# Altium project AMC_FMC_Carrier v4.PrjPcb (part 6 of 18)

## Sheet FPGA_SUP.SchDoc: AMC FMC Carrier v4
size A2; Organization: WUT ISE; Address1: Warsaw Univeristy of Technology; Address2: Nowowiejska 15/19 00-665 Warsaw; Address3: t.przywozki@gmail.com; DocumentNumber: 16; Revision: 1; SheetNumber: 4; SheetTotal: 29; Project: AMC_FMC_Carrier v4; ModifiedBy: -; CheckedDate: -; Title2: FPGA Power & Decoupling; DivGrp: ISE; Designer: T.Przywozki
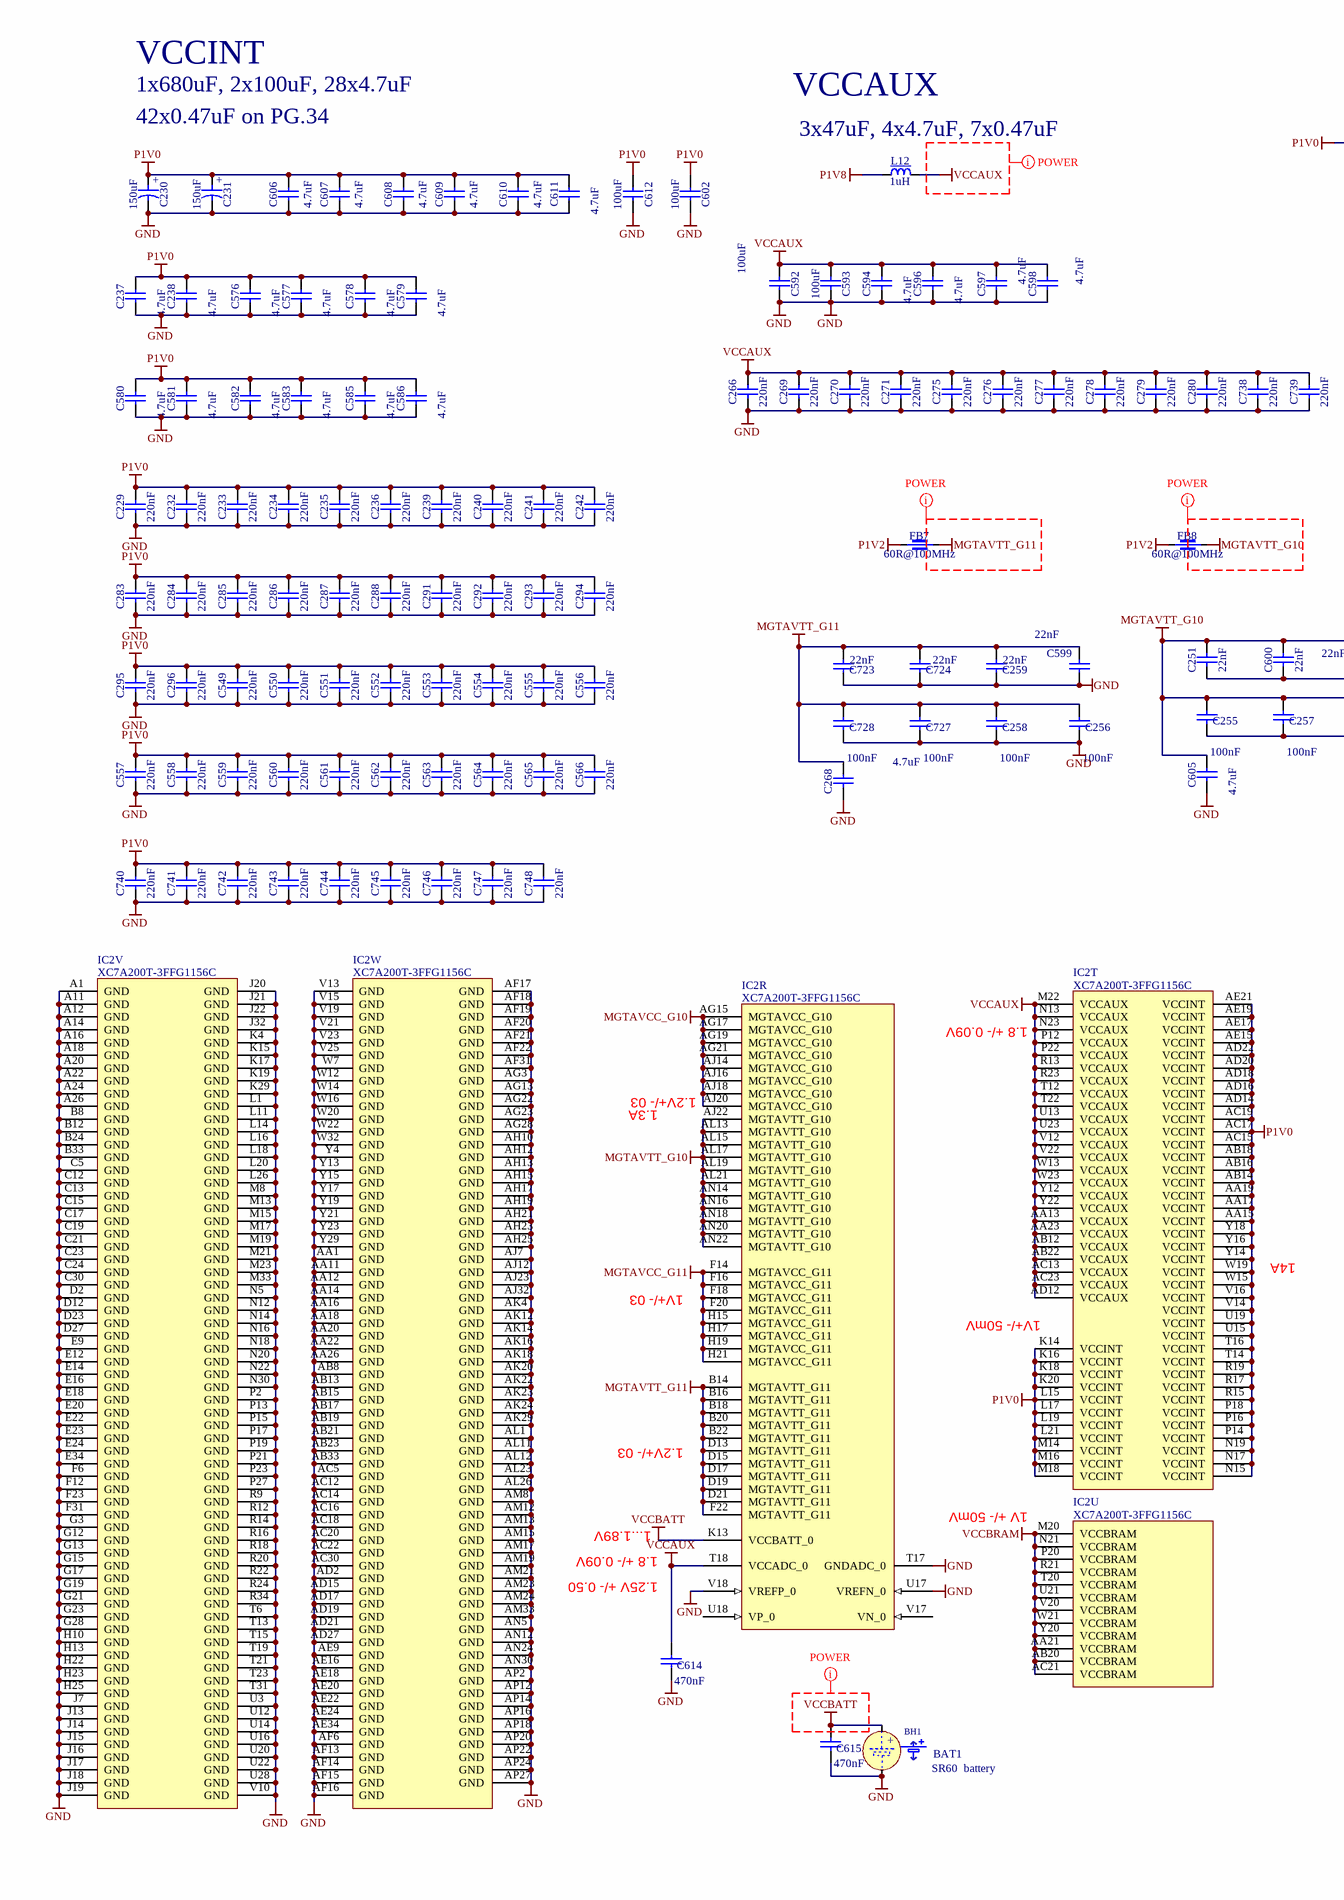
[diagram p10: FPGA_SUP.SchDoc, left]
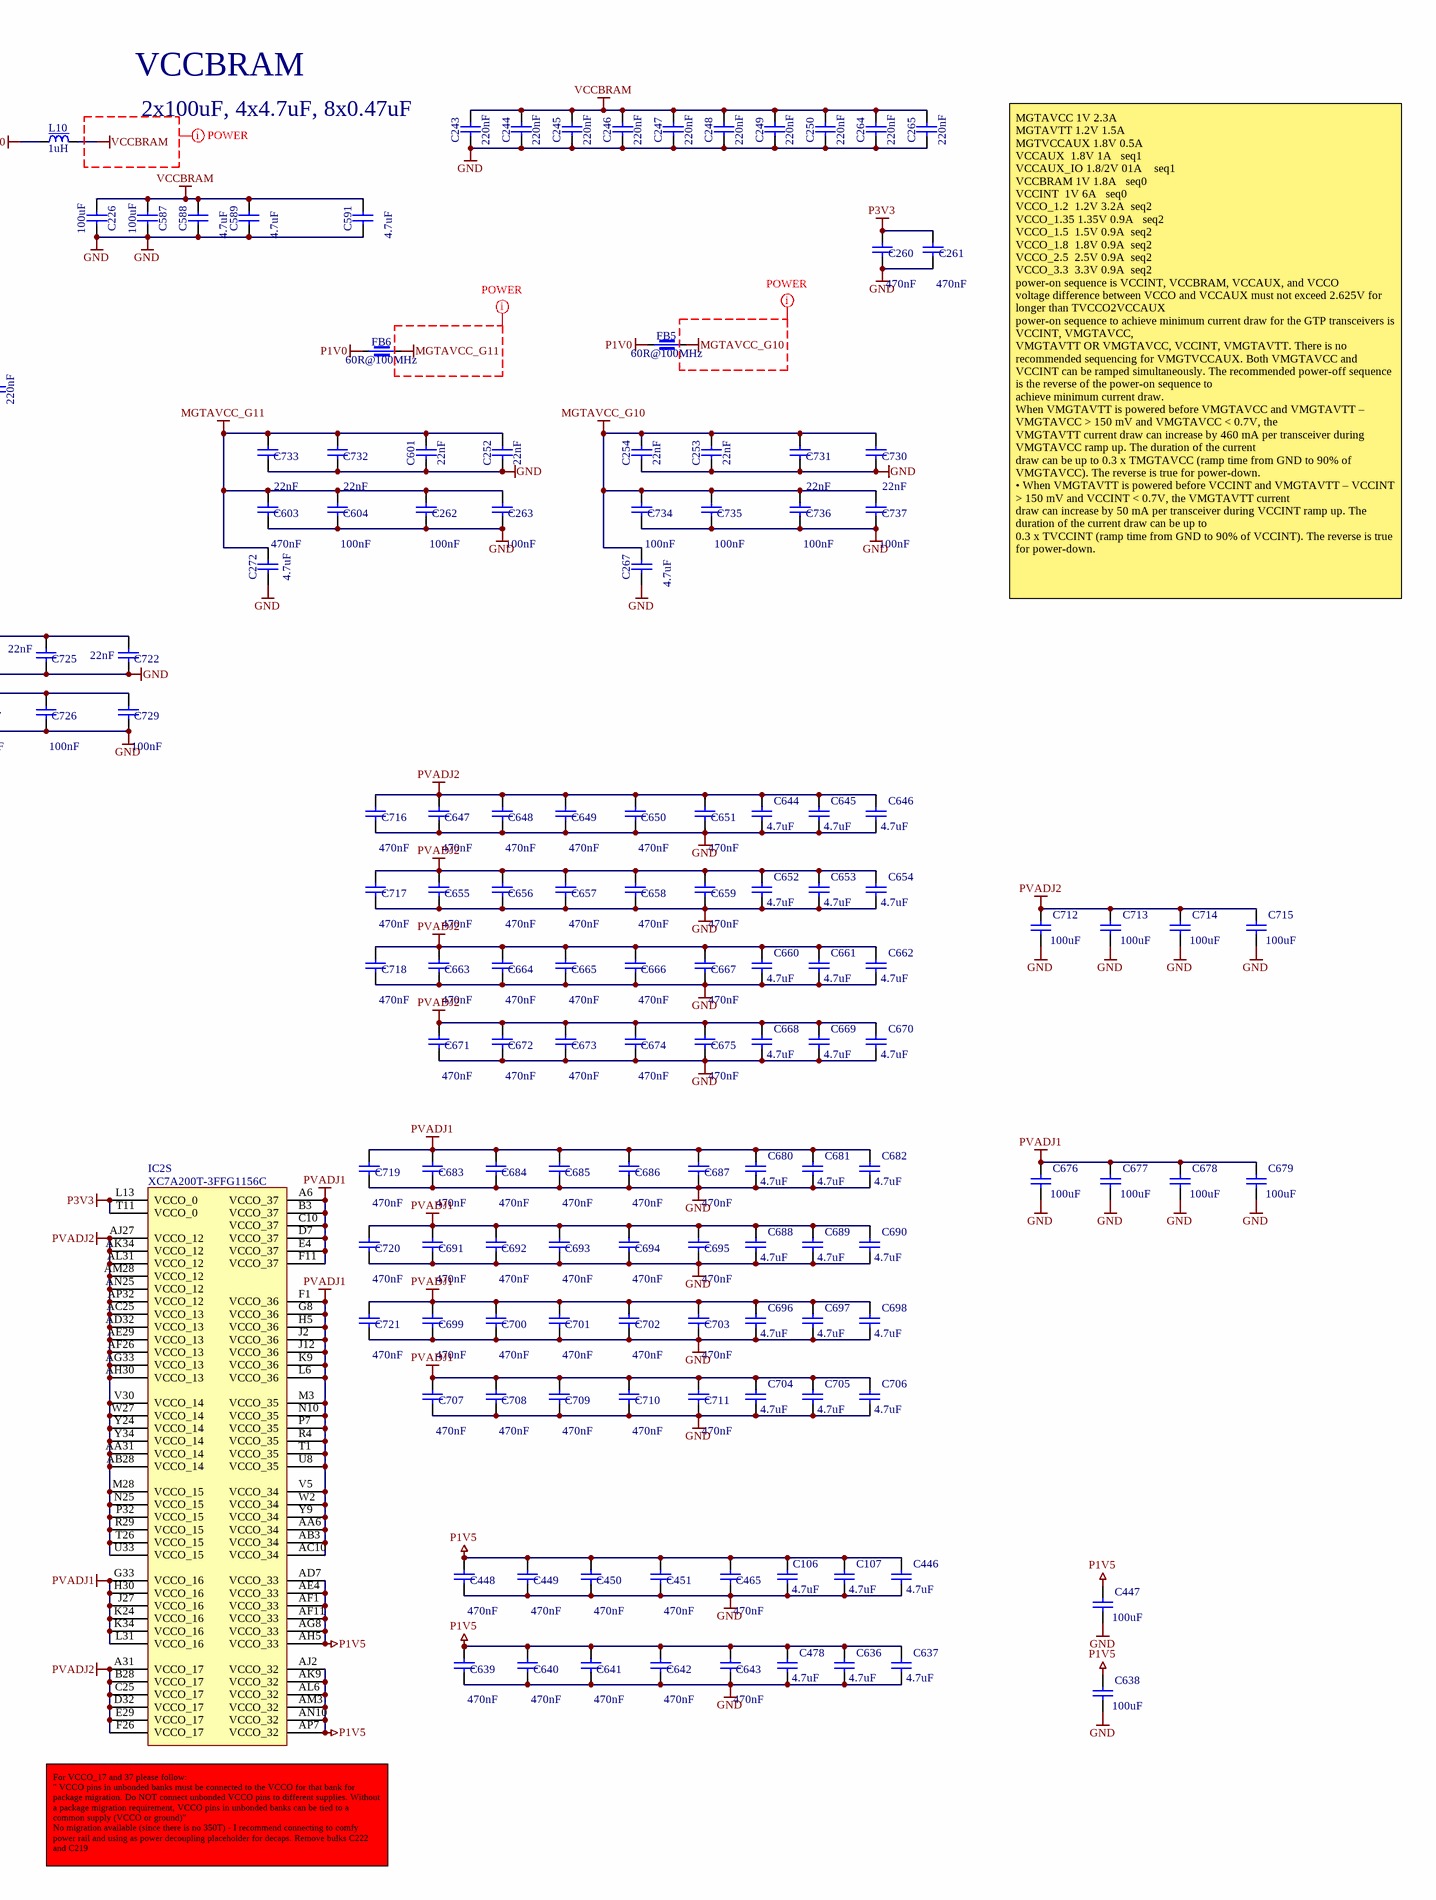
[diagram p11: FPGA_SUP.SchDoc, right]

### Parts
(Parts that share a designator on the sheet are numbered #1, #2 ... from top to bottom, then left to right.)
BAT1  SR60  battery  [SR60]
BH1  (no value)  [BATH_KEYSTONE_2998]
C106  4.7uF  [CAPC1608X87N]
C107  4.7uF  [CAPC1608X87N]
C226  100uF  [CAPC3225X270N]
C229  220nF  [CAPC0603X33N]
C230  150uF  [CAPMP7343X200N]
C231  150uF  [CAPMP7343X200N]
C232  220nF  [CAPC0603X33N]
C233  220nF  [CAPC0603X33N]
C234  220nF  [CAPC0603X33N]
C235  220nF  [CAPC0603X33N]
C236  220nF  [CAPC0603X33N]
C237  4.7uF  [CAPC1608X87N]
C238  4.7uF  [CAPC1608X87N]
C239  220nF  [CAPC0603X33N]
C240  220nF  [CAPC0603X33N]
C241  220nF  [CAPC0603X33N]
C242  220nF  [CAPC0603X33N]
C243  220nF  [CAPC0603X33N]
C244  220nF  [CAPC0603X33N]
C245  220nF  [CAPC0603X33N]
C246  220nF  [CAPC0603X33N]
C247  220nF  [CAPC0603X33N]
C248  220nF  [CAPC0603X33N]
C249  220nF  [CAPC0603X33N]
C250  220nF  [CAPC0603X33N]
C251  22nF  [CAPC0603X33N]
C252  22nF  [CAPC0603X33N]
C253  22nF  [CAPC0603X33N]
C254  22nF  [CAPC0603X33N]
C255  100nF  [CAPC0603X33N]
C256  100nF  [CAPC0603X33N]
C257  100nF  [CAPC0603X33N]
C258  100nF  [CAPC0603X33N]
C259  22nF  [CAPC0603X33N]
C260  470nF  [CAPC0603X33N]
C261  470nF  [CAPC0603X33N]
C262  100nF  [CAPC0603X33N]
C263  100nF  [CAPC0603X33N]
C264  220nF  [CAPC0603X33N]
C265  220nF  [CAPC0603X33N]
C266  220nF  [CAPC0603X33N]
C267  4.7uF  [CAPC1608X87N]
C268  4.7uF  [CAPC1608X87N]
C269  220nF  [CAPC0603X33N]
C270  220nF  [CAPC0603X33N]
C271  220nF  [CAPC0603X33N]
C272  4.7uF  [CAPC1608X87N]
C275  220nF  [CAPC0603X33N]
C276  220nF  [CAPC0603X33N]
C277  220nF  [CAPC0603X33N]
C278  220nF  [CAPC0603X33N]
C279  220nF  [CAPC0603X33N]
C280  220nF  [CAPC0603X33N]
C283  220nF  [CAPC0603X33N]
C284  220nF  [CAPC0603X33N]
C285  220nF  [CAPC0603X33N]
C286  220nF  [CAPC0603X33N]
C287  220nF  [CAPC0603X33N]
C288  220nF  [CAPC0603X33N]
C291  220nF  [CAPC0603X33N]
C292  220nF  [CAPC0603X33N]
C293  220nF  [CAPC0603X33N]
C294  220nF  [CAPC0603X33N]
C295  220nF  [CAPC0603X33N]
C296  220nF  [CAPC0603X33N]
C446  4.7uF  [CAPC1608X87N]
C447  100uF  [CAPC3225X270N]
C448  470nF  [CAPC0603X33N]
C449  470nF  [CAPC0603X33N]
C450  470nF  [CAPC0603X33N]
C451  470nF  [CAPC0603X33N]
C465  470nF  [CAPC0603X33N]
C478  4.7uF  [CAPC1608X87N]
C549  220nF  [CAPC0603X33N]
C550  220nF  [CAPC0603X33N]
C551  220nF  [CAPC0603X33N]
C552  220nF  [CAPC0603X33N]
C553  220nF  [CAPC0603X33N]
C554  220nF  [CAPC0603X33N]
C555  220nF  [CAPC0603X33N]
C556  220nF  [CAPC0603X33N]
C557  220nF  [CAPC0603X33N]
C558  220nF  [CAPC0603X33N]
C559  220nF  [CAPC0603X33N]
C560  220nF  [CAPC0603X33N]
C561  220nF  [CAPC0603X33N]
C562  220nF  [CAPC0603X33N]
C563  220nF  [CAPC0603X33N]
C564  220nF  [CAPC0603X33N]
C565  220nF  [CAPC0603X33N]
C566  220nF  [CAPC0603X33N]
C576  4.7uF  [CAPC1608X87N]
C577  4.7uF  [CAPC1608X87N]
C578  4.7uF  [CAPC1608X87N]
C579  4.7uF  [CAPC1608X87N]
C580  4.7uF  [CAPC1608X87N]
C581  4.7uF  [CAPC1608X87N]
C582  4.7uF  [CAPC1608X87N]
C583  4.7uF  [CAPC1608X87N]
C585  4.7uF  [CAPC1608X87N]
C586  4.7uF  [CAPC1608X87N]
C587  100uF  [CAPC3225X270N]
C588  4.7uF  [CAPC1608X87N]
C589  4.7uF  [CAPC1608X87N]
C591  4.7uF  [CAPC1608X87N]
C592  100uF  [CAPC3225X270N]
C593  100uF  [CAPC3225X270N]
C594  4.7uF  [CAPC1608X87N]
C596  4.7uF  [CAPC1608X87N]
C597  4.7uF  [CAPC1608X87N]
C598  4.7uF  [CAPC1608X87N]
C599  22nF  [CAPC0603X33N]
C600  22nF  [CAPC0603X33N]
C601  22nF  [CAPC0603X33N]
C602  100uF  [CAPC3225X270N]
C603  470nF  [CAPC0603X33N]
C604  100nF  [CAPC0603X33N]
C605  4.7uF  [CAPC1608X87N]
C606  4.7uF  [CAPC1608X87N]
C607  4.7uF  [CAPC1608X87N]
C608  4.7uF  [CAPC1608X87N]
C609  4.7uF  [CAPC1608X87N]
C610  4.7uF  [CAPC1608X87N]
C611  4.7uF  [CAPC1608X87N]
C612  100uF  [CAPC3225X270N]
C614  470nF  [CAPC0603X33N]
C615  470nF  [CAPC0603X33N]
C636  4.7uF  [CAPC1608X87N]
C637  4.7uF  [CAPC1608X87N]
C638  100uF  [CAPC3225X270N]
C639  470nF  [CAPC0603X33N]
C640  470nF  [CAPC0603X33N]
C641  470nF  [CAPC0603X33N]
C642  470nF  [CAPC0603X33N]
C643  470nF  [CAPC0603X33N]
C644  4.7uF  [CAPC1608X87N]
C645  4.7uF  [CAPC1608X87N]
C646  4.7uF  [CAPC1608X87N]
C647  470nF  [CAPC0603X33N]
C648  470nF  [CAPC0603X33N]
C649  470nF  [CAPC0603X33N]
C650  470nF  [CAPC0603X33N]
C651  470nF  [CAPC0603X33N]
C652  4.7uF  [CAPC1608X87N]
C653  4.7uF  [CAPC1608X87N]
C654  4.7uF  [CAPC1608X87N]
C655  470nF  [CAPC0603X33N]
C656  470nF  [CAPC0603X33N]
C657  470nF  [CAPC0603X33N]
C658  470nF  [CAPC0603X33N]
C659  470nF  [CAPC0603X33N]
C660  4.7uF  [CAPC1608X87N]
C661  4.7uF  [CAPC1608X87N]
C662  4.7uF  [CAPC1608X87N]
C663  470nF  [CAPC0603X33N]
C664  470nF  [CAPC0603X33N]
C665  470nF  [CAPC0603X33N]
C666  470nF  [CAPC0603X33N]
C667  470nF  [CAPC0603X33N]
C668  4.7uF  [CAPC1608X87N]
C669  4.7uF  [CAPC1608X87N]
C670  4.7uF  [CAPC1608X87N]
C671  470nF  [CAPC0603X33N]
C672  470nF  [CAPC0603X33N]
C673  470nF  [CAPC0603X33N]
C674  470nF  [CAPC0603X33N]
C675  470nF  [CAPC0603X33N]
C676  100uF  [CAPC3225X270N]
C677  100uF  [CAPC3225X270N]
C678  100uF  [CAPC3225X270N]
C679  100uF  [CAPC3225X270N]
C680  4.7uF  [CAPC1608X87N]
C681  4.7uF  [CAPC1608X87N]
C682  4.7uF  [CAPC1608X87N]
C683  470nF  [CAPC0603X33N]
C684  470nF  [CAPC0603X33N]
C685  470nF  [CAPC0603X33N]
C686  470nF  [CAPC0603X33N]
C687  470nF  [CAPC0603X33N]
C688  4.7uF  [CAPC1608X87N]
C689  4.7uF  [CAPC1608X87N]
C690  4.7uF  [CAPC1608X87N]
C691  470nF  [CAPC0603X33N]
C692  470nF  [CAPC0603X33N]
C693  470nF  [CAPC0603X33N]
C694  470nF  [CAPC0603X33N]
C695  470nF  [CAPC0603X33N]
C696  4.7uF  [CAPC1608X87N]
C697  4.7uF  [CAPC1608X87N]
C698  4.7uF  [CAPC1608X87N]
C699  470nF  [CAPC0603X33N]
C700  470nF  [CAPC0603X33N]
C701  470nF  [CAPC0603X33N]
C702  470nF  [CAPC0603X33N]
C703  470nF  [CAPC0603X33N]
C704  4.7uF  [CAPC1608X87N]
C705  4.7uF  [CAPC1608X87N]
C706  4.7uF  [CAPC1608X87N]
C707  470nF  [CAPC0603X33N]
C708  470nF  [CAPC0603X33N]
C709  470nF  [CAPC0603X33N]
C710  470nF  [CAPC0603X33N]
C711  470nF  [CAPC0603X33N]
C712  100uF  [CAPC3225X270N]
C713  100uF  [CAPC3225X270N]
C714  100uF  [CAPC3225X270N]
C715  100uF  [CAPC3225X270N]
C716  470nF  [CAPC0603X33N]
C717  470nF  [CAPC0603X33N]
C718  470nF  [CAPC0603X33N]
C719  470nF  [CAPC0603X33N]
C720  470nF  [CAPC0603X33N]
C721  470nF  [CAPC0603X33N]
C722  22nF  [CAPC0603X33N]
C723  22nF  [CAPC0603X33N]
C724  22nF  [CAPC0603X33N]
C725  22nF  [CAPC0603X33N]
C726  100nF  [CAPC0603X33N]
C727  100nF  [CAPC0603X33N]
C728  100nF  [CAPC0603X33N]
C729  100nF  [CAPC0603X33N]
C730  22nF  [CAPC0603X33N]
C731  22nF  [CAPC0603X33N]
C732  22nF  [CAPC0603X33N]
C733  22nF  [CAPC0603X33N]
C734  100nF  [CAPC0603X33N]
C735  100nF  [CAPC0603X33N]
C736  100nF  [CAPC0603X33N]
C737  100nF  [CAPC0603X33N]
C738  220nF  [CAPC0603X33N]
C739  220nF  [CAPC0603X33N]
C740  220nF  [CAPC0603X33N]
C741  220nF  [CAPC0603X33N]
C742  220nF  [CAPC0603X33N]
C743  220nF  [CAPC0603X33N]
C744  220nF  [CAPC0603X33N]
C745  220nF  [CAPC0603X33N]
C746  220nF  [CAPC0603X33N]
C747  220nF  [CAPC0603X33N]
C748  220nF  [CAPC0603X33N]
FB5  60R@100MHz  [INDC4516X180N]
FB6  60R@100MHz  [INDC4516X180N]
FB7  60R@100MHz  [INDC4516X180N]
FB8  60R@100MHz  [INDC4516X180N]
IC2#2  XC7A200T-3FFG1156C  [BGA1156C100P34X34_3500X3500X335]  (parts R,S,T,U,V,W of 23)
L10  1uH  [IND_PANASONIC_ELLVGG]
L12  1uH  [IND_PANASONIC_ELLVGG]

### Nets
GND: BH1.2(MINUS) C106.1 C107.1 C226.2 C229.1 C230.2 C231.2 C232.1 C233.1 C234.1 C235.1 C236.1 C237.1 C238.1 C239.1 C240.1 C241.1 C242.1 C243.1 C244.1 C245.1 C246.1 C247.1 C248.1 C249.1 C250.1 C251.1 C252.1 C253.1 C254.1 C255.1 C256.1 C257.1 C258.1 C259.1 C260.1 C261.1 C262.1 C263.1 C264.1 C265.1 C266.1 C267.1 C268.1 C269.1 C270.1 C271.1 C272.1 C275.1 C276.1 C277.1 C278.1 C279.1 C280.1 C283.1 C284.1 C285.1 C286.1 C287.1 C288.1 C291.1 C292.1 C293.1 C294.1 C295.1 C296.1 C446.1 C447.2 C448.1 C449.1 C450.1 C451.1 C465.1 C478.1 C549.1 C550.1 C551.1 C552.1 C553.1 C554.1 C555.1 C556.1 C557.1 C558.1 C559.1 C560.1 C561.1 C562.1 C563.1 C564.1 C565.1 C566.1 C576.1 C577.1 C578.1 C579.1 C580.1 C581.1 C582.1 C583.1 C585.1 C586.1 C587.2 C588.1 C589.1 C591.1 C592.2 C593.2 C594.1 C596.1 C597.1 C598.1 C599.1 C600.1 C601.1 C602.2 C603.1 C604.1 C605.1 C606.1 C607.1 C608.1 C609.1 C610.1 C611.1 C612.2 C614.1 C615.1 C636.1 C637.1 C638.2 C639.1 C640.1 C641.1 C642.1 C643.1 C644.1 C645.1 C646.1 C647.1 C648.1 C649.1 C650.1 C651.1 C652.1 C653.1 C654.1 C655.1 C656.1 C657.1 C658.1 C659.1 C660.1 C661.1 C662.1 C663.1 C664.1 C665.1 C666.1 C667.1 C668.1 C669.1 C670.1 C671.1 C672.1 C673.1 C674.1 C675.1 C676.2 C677.2 C678.2 C679.2 C680.1 C681.1 C682.1 C683.1 C684.1 C685.1 C686.1 C687.1 C688.1 C689.1 C690.1 C691.1 C692.1 C693.1 C694.1 C695.1 C696.1 C697.1 C698.1 C699.1 C700.1 C701.1 C702.1 C703.1 C704.1 C705.1 C706.1 C707.1 C708.1 C709.1 C710.1 C711.1 C712.2 C713.2 C714.2 C715.2 C716.1 C717.1 C718.1 C719.1 C720.1 C721.1 C722.1 C723.1 C724.1 C725.1 C726.1 C727.1 C728.1 C729.1 C730.1 C731.1 C732.1 C733.1 C734.1 C735.1 C736.1 C737.1 C738.1 C739.1 C740.1 C741.1 C742.1 C743.1 C744.1 C745.1 C746.1 C747.1 C748.1 IC2#2.A1(GND) IC2#2.A11(GND) IC2#2.A12(GND) IC2#2.A14(GND) IC2#2.A16(GND) IC2#2.A18(GND) IC2#2.A20(GND) IC2#2.A22(GND) IC2#2.A24(GND) IC2#2.A26(GND) IC2#2.AA1(GND) IC2#2.AA11(GND) IC2#2.AA12(GND) IC2#2.AA14(GND) IC2#2.AA16(GND) IC2#2.AA18(GND) IC2#2.AA20(GND) IC2#2.AA22(GND) IC2#2.AA26(GND) IC2#2.AB8(GND) IC2#2.AB13(GND) IC2#2.AB15(GND) IC2#2.AB17(GND) IC2#2.AB19(GND) IC2#2.AB21(GND) IC2#2.AB23(GND) IC2#2.AB33(GND) IC2#2.AC5(GND) IC2#2.AC12(GND) IC2#2.AC14(GND) IC2#2.AC16(GND) IC2#2.AC18(GND) IC2#2.AC20(GND) IC2#2.AC22(GND) IC2#2.AC30(GND) IC2#2.AD2(GND) IC2#2.AD15(GND) IC2#2.AD17(GND) IC2#2.AD19(GND) IC2#2.AD21(GND) IC2#2.AD27(GND) IC2#2.AE9(GND) IC2#2.AE16(GND) IC2#2.AE18(GND) IC2#2.AE20(GND) IC2#2.AE22(GND) IC2#2.AE24(GND) IC2#2.AE34(GND) IC2#2.AF6(GND) IC2#2.AF13(GND) IC2#2.AF14(GND) IC2#2.AF15(GND) IC2#2.AF16(GND) IC2#2.AF17(GND) IC2#2.AF18(GND) IC2#2.AF19(GND) IC2#2.AF20(GND) IC2#2.AF21(GND) IC2#2.AF22(GND) IC2#2.AF31(GND) IC2#2.AG3(GND) IC2#2.AG13(GND) IC2#2.AG22(GND) IC2#2.AG23(GND) IC2#2.AG28(GND) IC2#2.AH10(GND) IC2#2.AH12(GND) IC2#2.AH13(GND) IC2#2.AH15(GND) IC2#2.AH17(GND) IC2#2.AH19(GND) IC2#2.AH21(GND) IC2#2.AH23(GND) IC2#2.AH25(GND) IC2#2.AJ7(GND) IC2#2.AJ12(GND) IC2#2.AJ23(GND) IC2#2.AJ32(GND) IC2#2.AK4(GND) IC2#2.AK12(GND) IC2#2.AK14(GND) IC2#2.AK16(GND) IC2#2.AK18(GND) IC2#2.AK20(GND) IC2#2.AK22(GND) IC2#2.AK23(GND) IC2#2.AK24(GND) IC2#2.AK29(GND) IC2#2.AL1(GND) IC2#2.AL11(GND) IC2#2.AL12(GND) IC2#2.AL23(GND) IC2#2.AL26(GND) IC2#2.AM8(GND) IC2#2.AM12(GND) IC2#2.AM13(GND) IC2#2.AM15(GND) IC2#2.AM17(GND) IC2#2.AM19(GND) IC2#2.AM21(GND) IC2#2.AM23(GND) IC2#2.AM24(GND) IC2#2.AM33(GND) IC2#2.AN5(GND) IC2#2.AN12(GND) IC2#2.AN24(GND) IC2#2.AN30(GND) IC2#2.AP2(GND) IC2#2.AP12(GND) IC2#2.AP14(GND) IC2#2.AP16(GND) IC2#2.AP18(GND) IC2#2.AP20(GND) IC2#2.AP22(GND) IC2#2.AP24(GND) IC2#2.AP27(GND) IC2#2.B8(GND) IC2#2.B12(GND) IC2#2.B24(GND) IC2#2.B33(GND) IC2#2.C5(GND) IC2#2.C12(GND) IC2#2.C13(GND) IC2#2.C15(GND) IC2#2.C17(GND) IC2#2.C19(GND) IC2#2.C21(GND) IC2#2.C23(GND) IC2#2.C24(GND) IC2#2.C30(GND) IC2#2.D2(GND) IC2#2.D12(GND) IC2#2.D23(GND) IC2#2.D27(GND) IC2#2.E9(GND) IC2#2.E12(GND) IC2#2.E14(GND) IC2#2.E16(GND) IC2#2.E18(GND) IC2#2.E20(GND) IC2#2.E22(GND) IC2#2.E23(GND) IC2#2.E24(GND) IC2#2.E34(GND) IC2#2.F6(GND) IC2#2.F12(GND) IC2#2.F23(GND) IC2#2.F31(GND) IC2#2.G3(GND) IC2#2.G12(GND) IC2#2.G13(GND) IC2#2.G15(GND) IC2#2.G17(GND) IC2#2.G19(GND) IC2#2.G21(GND) IC2#2.G23(GND) IC2#2.G28(GND) IC2#2.H10(GND) IC2#2.H13(GND) IC2#2.H22(GND) IC2#2.H23(GND) IC2#2.H25(GND) IC2#2.J7(GND) IC2#2.J13(GND) IC2#2.J14(GND) IC2#2.J15(GND) IC2#2.J16(GND) IC2#2.J17(GND) IC2#2.J18(GND) IC2#2.J19(GND) IC2#2.J20(GND) IC2#2.J21(GND) IC2#2.J22(GND) IC2#2.J32(GND) IC2#2.K4(GND) IC2#2.K15(GND) IC2#2.K17(GND) IC2#2.K19(GND) IC2#2.K29(GND) IC2#2.L1(GND) IC2#2.L11(GND) IC2#2.L14(GND) IC2#2.L16(GND) IC2#2.L18(GND) IC2#2.L20(GND) IC2#2.L26(GND) IC2#2.M8(GND) IC2#2.M13(GND) IC2#2.M15(GND) IC2#2.M17(GND) IC2#2.M19(GND) IC2#2.M21(GND) IC2#2.M23(GND) IC2#2.M33(GND) IC2#2.N5(GND) IC2#2.N12(GND) IC2#2.N14(GND) IC2#2.N16(GND) IC2#2.N18(GND) IC2#2.N20(GND) IC2#2.N22(GND) IC2#2.N30(GND) IC2#2.P2(GND) IC2#2.P13(GND) IC2#2.P15(GND) IC2#2.P17(GND) IC2#2.P19(GND) IC2#2.P21(GND) IC2#2.P23(GND) IC2#2.P27(GND) IC2#2.R9(GND) IC2#2.R12(GND) IC2#2.R14(GND) IC2#2.R16(GND) IC2#2.R18(GND) IC2#2.R20(GND) IC2#2.R22(GND) IC2#2.R24(GND) IC2#2.R34(GND) IC2#2.T6(GND) IC2#2.T13(GND) IC2#2.T15(GND) IC2#2.T17(GNDADC_0) IC2#2.T19(GND) IC2#2.T21(GND) IC2#2.T23(GND) IC2#2.T31(GND) IC2#2.U3(GND) IC2#2.U12(GND) IC2#2.U14(GND) IC2#2.U16(GND) IC2#2.U17(VREFN_0) IC2#2.U20(GND) IC2#2.U22(GND) IC2#2.U28(GND) IC2#2.V10(GND) IC2#2.V13(GND) IC2#2.V15(GND) IC2#2.V18(VREFP_0) IC2#2.V19(GND) IC2#2.V21(GND) IC2#2.V23(GND) IC2#2.V25(GND) IC2#2.W7(GND) IC2#2.W12(GND) IC2#2.W14(GND) IC2#2.W16(GND) IC2#2.W20(GND) IC2#2.W22(GND) IC2#2.W32(GND) IC2#2.Y4(GND) IC2#2.Y13(GND) IC2#2.Y15(GND) IC2#2.Y17(GND) IC2#2.Y19(GND) IC2#2.Y21(GND) IC2#2.Y23(GND) IC2#2.Y29(GND)
MGTAVCC_G10: C253.2 C254.2 C267.2 C730.2 C731.2 C734.2 C735.2 C736.2 C737.2 FB5.2 IC2#2.AG15(MGTAVCC_G10) IC2#2.AG17(MGTAVCC_G10) IC2#2.AG19(MGTAVCC_G10) IC2#2.AG21(MGTAVCC_G10) IC2#2.AJ14(MGTAVCC_G10) IC2#2.AJ16(MGTAVCC_G10) IC2#2.AJ18(MGTAVCC_G10) IC2#2.AJ20(MGTAVCC_G10)
MGTAVCC_G11: C252.2 C262.2 C263.2 C272.2 C601.2 C603.2 C604.2 C732.2 C733.2 FB6.2 IC2#2.F14(MGTAVCC_G11) IC2#2.F16(MGTAVCC_G11) IC2#2.F18(MGTAVCC_G11) IC2#2.F20(MGTAVCC_G11) IC2#2.H15(MGTAVCC_G11) IC2#2.H17(MGTAVCC_G11) IC2#2.H19(MGTAVCC_G11) IC2#2.H21(MGTAVCC_G11)
MGTAVTT_G10: C251.2 C255.2 C257.2 C600.2 C605.2 C722.2 C725.2 C726.2 C729.2 FB8.2 IC2#2.AJ22(MGTAVTT_G10) IC2#2.AL13(MGTAVTT_G10) IC2#2.AL15(MGTAVTT_G10) IC2#2.AL17(MGTAVTT_G10) IC2#2.AL19(MGTAVTT_G10) IC2#2.AL21(MGTAVTT_G10) IC2#2.AN14(MGTAVTT_G10) IC2#2.AN16(MGTAVTT_G10) IC2#2.AN18(MGTAVTT_G10) IC2#2.AN20(MGTAVTT_G10) IC2#2.AN22(MGTAVTT_G10)
MGTAVTT_G11: C256.2 C258.2 C259.2 C268.2 C599.2 C723.2 C724.2 C727.2 C728.2 FB7.2 IC2#2.B14(MGTAVTT_G11) IC2#2.B16(MGTAVTT_G11) IC2#2.B18(MGTAVTT_G11) IC2#2.B20(MGTAVTT_G11) IC2#2.B22(MGTAVTT_G11) IC2#2.D13(MGTAVTT_G11) IC2#2.D15(MGTAVTT_G11) IC2#2.D17(MGTAVTT_G11) IC2#2.D19(MGTAVTT_G11) IC2#2.D21(MGTAVTT_G11) IC2#2.F22(MGTAVTT_G11)
P1V0: C229.2 C230.1 C231.1 C232.2 C233.2 C234.2 C235.2 C236.2 C237.2 C238.2 C239.2 C240.2 C241.2 C242.2 C283.2 C284.2 C285.2 C286.2 C287.2 C288.2 C291.2 C292.2 C293.2 C294.2 C295.2 C296.2 C549.2 C550.2 C551.2 C552.2 C553.2 C554.2 C555.2 C556.2 C557.2 C558.2 C559.2 C560.2 C561.2 C562.2 C563.2 C564.2 C565.2 C566.2 C576.2 C577.2 C578.2 C579.2 C580.2 C581.2 C582.2 C583.2 C585.2 C586.2 C602.1 C606.2 C607.2 C608.2 C609.2 C610.2 C611.2 C612.1 C740.2 C741.2 C742.2 C743.2 C744.2 C745.2 C746.2 C747.2 C748.2 FB5.1 FB6.1 IC2#2.AA15(VCCINT) IC2#2.AA17(VCCINT) IC2#2.AA19(VCCINT) IC2#2.AB14(VCCINT) IC2#2.AB16(VCCINT) IC2#2.AB18(VCCINT) IC2#2.AC15(VCCINT) IC2#2.AC17(VCCINT) IC2#2.AC19(VCCINT) IC2#2.AD14(VCCINT) IC2#2.AD16(VCCINT) IC2#2.AD18(VCCINT) IC2#2.AD20(VCCINT) IC2#2.AD22(VCCINT) IC2#2.AE15(VCCINT) IC2#2.AE17(VCCINT) IC2#2.AE19(VCCINT) IC2#2.AE21(VCCINT) IC2#2.K14(VCCINT) IC2#2.K16(VCCINT) IC2#2.K18(VCCINT) IC2#2.K20(VCCINT) IC2#2.L15(VCCINT) IC2#2.L17(VCCINT) IC2#2.L19(VCCINT) IC2#2.L21(VCCINT) IC2#2.M14(VCCINT) IC2#2.M16(VCCINT) IC2#2.M18(VCCINT) IC2#2.N15(VCCINT) IC2#2.N17(VCCINT) IC2#2.N19(VCCINT) IC2#2.P14(VCCINT) IC2#2.P16(VCCINT) IC2#2.P18(VCCINT) IC2#2.R15(VCCINT) IC2#2.R17(VCCINT) IC2#2.R19(VCCINT) IC2#2.T14(VCCINT) IC2#2.T16(VCCINT) IC2#2.U15(VCCINT) IC2#2.U19(VCCINT) IC2#2.V14(VCCINT) IC2#2.V16(VCCINT) IC2#2.W15(VCCINT) IC2#2.W19(VCCINT) IC2#2.Y14(VCCINT) IC2#2.Y16(VCCINT) IC2#2.Y18(VCCINT) L10.1
P1V2: FB7.1 FB8.1
P1V5: C106.2 C107.2 C446.2 C447.1 C448.2 C449.2 C450.2 C451.2 C465.2 C478.2 C636.2 C637.2 C638.1 C639.2 C640.2 C641.2 C642.2 C643.2 IC2#2.AD7(VCCO_33) IC2#2.AE4(VCCO_33) IC2#2.AF1(VCCO_33) IC2#2.AF11(VCCO_33) IC2#2.AG8(VCCO_33) IC2#2.AH5(VCCO_33) IC2#2.AJ2(VCCO_32) IC2#2.AK9(VCCO_32) IC2#2.AL6(VCCO_32) IC2#2.AM3(VCCO_32) IC2#2.AN10(VCCO_32) IC2#2.AP7(VCCO_32)
P1V8: L12.1
P3V3: C260.2 C261.2 IC2#2.L13(VCCO_0) IC2#2.T11(VCCO_0)
PVADJ1: C676.1 C677.1 C678.1 C679.1 C680.2 C681.2 C682.2 C683.2 C684.2 C685.2 C686.2 C687.2 C688.2 C689.2 C690.2 C691.2 C692.2 C693.2 C694.2 C695.2 C696.2 C697.2 C698.2 C699.2 C700.2 C701.2 C702.2 C703.2 C704.2 C705.2 C706.2 C707.2 C708.2 C709.2 C710.2 C711.2 C719.2 C720.2 C721.2 IC2#2.A6(VCCO_37) IC2#2.AA6(VCCO_34) IC2#2.AB3(VCCO_34) IC2#2.AC10(VCCO_34) IC2#2.B3(VCCO_37) IC2#2.C10(VCCO_37) IC2#2.D7(VCCO_37) IC2#2.E4(VCCO_37) IC2#2.F1(VCCO_36) IC2#2.F11(VCCO_37) IC2#2.G8(VCCO_36) IC2#2.G33(VCCO_16) IC2#2.H5(VCCO_36) IC2#2.H30(VCCO_16) IC2#2.J2(VCCO_36) IC2#2.J12(VCCO_36) IC2#2.J27(VCCO_16) IC2#2.K9(VCCO_36) IC2#2.K24(VCCO_16) IC2#2.K34(VCCO_16) IC2#2.L6(VCCO_36) IC2#2.L31(VCCO_16) IC2#2.M3(VCCO_35) IC2#2.N10(VCCO_35) IC2#2.P7(VCCO_35) IC2#2.R4(VCCO_35) IC2#2.T1(VCCO_35) IC2#2.U8(VCCO_35) IC2#2.V5(VCCO_34) IC2#2.W2(VCCO_34) IC2#2.Y9(VCCO_34)
PVADJ2: C644.2 C645.2 C646.2 C647.2 C648.2 C649.2 C650.2 C651.2 C652.2 C653.2 C654.2 C655.2 C656.2 C657.2 C658.2 C659.2 C660.2 C661.2 C662.2 C663.2 C664.2 C665.2 C666.2 C667.2 C668.2 C669.2 C670.2 C671.2 C672.2 C673.2 C674.2 C675.2 C712.1 C713.1 C714.1 C715.1 C716.2 C717.2 C718.2 IC2#2.A31(VCCO_17) IC2#2.AA31(VCCO_14) IC2#2.AB28(VCCO_14) IC2#2.AC25(VCCO_13) IC2#2.AD32(VCCO_13) IC2#2.AE29(VCCO_13) IC2#2.AF26(VCCO_13) IC2#2.AG33(VCCO_13) IC2#2.AH30(VCCO_13) IC2#2.AJ27(VCCO_12) IC2#2.AK34(VCCO_12) IC2#2.AL31(VCCO_12) IC2#2.AM28(VCCO_12) IC2#2.AN25(VCCO_12) IC2#2.AP32(VCCO_12) IC2#2.B28(VCCO_17) IC2#2.C25(VCCO_17) IC2#2.D32(VCCO_17) IC2#2.E29(VCCO_17) IC2#2.F26(VCCO_17) IC2#2.M28(VCCO_15) IC2#2.N25(VCCO_15) IC2#2.P32(VCCO_15) IC2#2.R29(VCCO_15) IC2#2.T26(VCCO_15) IC2#2.U33(VCCO_15) IC2#2.V30(VCCO_14) IC2#2.W27(VCCO_14) IC2#2.Y24(VCCO_14) IC2#2.Y34(VCCO_14)
VCCAUX: C266.2 C269.2 C270.2 C271.2 C275.2 C276.2 C277.2 C278.2 C279.2 C280.2 C592.1 C593.1 C594.2 C596.2 C597.2 C598.2 C614.2 C738.2 C739.2 IC2#2.AA13(VCCAUX) IC2#2.AA23(VCCAUX) IC2#2.AB12(VCCAUX) IC2#2.AB22(VCCAUX) IC2#2.AC13(VCCAUX) IC2#2.AC23(VCCAUX) IC2#2.AD12(VCCAUX) IC2#2.M22(VCCAUX) IC2#2.N13(VCCAUX) IC2#2.N23(VCCAUX) IC2#2.P12(VCCAUX) IC2#2.P22(VCCAUX) IC2#2.R13(VCCAUX) IC2#2.R23(VCCAUX) IC2#2.T12(VCCAUX) IC2#2.T18(VCCADC_0) IC2#2.T22(VCCAUX) IC2#2.U13(VCCAUX) IC2#2.U23(VCCAUX) IC2#2.V12(VCCAUX) IC2#2.V22(VCCAUX) IC2#2.W13(VCCAUX) IC2#2.W23(VCCAUX) IC2#2.Y12(VCCAUX) IC2#2.Y22(VCCAUX) L12.2
VCCBATT: BH1.1(PLUS) C615.2 IC2#2.K13(VCCBATT_0)
VCCBRAM: C226.1 C243.2 C244.2 C245.2 C246.2 C247.2 C248.2 C249.2 C250.2 C264.2 C265.2 C587.1 C588.2 C589.2 C591.2 IC2#2.AA21(VCCBRAM) IC2#2.AB20(VCCBRAM) IC2#2.AC21(VCCBRAM) IC2#2.M20(VCCBRAM) IC2#2.N21(VCCBRAM) IC2#2.P20(VCCBRAM) IC2#2.R21(VCCBRAM) IC2#2.T20(VCCBRAM) IC2#2.U21(VCCBRAM) IC2#2.V20(VCCBRAM) IC2#2.W21(VCCBRAM) IC2#2.Y20(VCCBRAM) L10.2

Not connected (* = marked no-connect by the designer): IC2#2 U18(VP_0) V17(VN_0)

### Layout directives
net class POWER: MGTAVCC_G10, MGTAVCC_G11, MGTAVTT_G10, MGTAVTT_G11, VCCAUX, VCCBATT, VCCBRAM

### Notes on the sheet
- VCCINT
- 1x680uF, 2x100uF, 28x4.7uF
- VCCAUX
- VCCBRAM
- 42x0.47uF on PG.34
- (near L12) 3x47uF, 4x4.7uF, 7x0.47uF
- (near C243) 2x100uF, 4x4.7uF, 8x0.47uF
- MGTAVCC	1V	2.3A
  MGTAVTT	1.2V	1.5A
  MGTVCCAUX	1.8V	0.5A
  VCCAUX		1.8V	1A			seq1
  VCCAUX_IO	1.8/2V	01A 			seq1
  VCCBRAM	1V	1.8A			seq0
  VCCINT		1V	6A			seq0
  VCCO_1.2		1.2V	3.2A		seq2
  VCCO_1.35	1.35V	0.9A			seq2
  VCCO_1.5		1.5V	0.9A		seq2
  VCCO_1.8		1.8V	0.9A		seq2
  VCCO_2.5		2.5V	0.9A		seq2
  VCCO_3.3		3.3V	0.9A		seq2
  power-on sequence is VCCINT, VCCBRAM, VCCAUX, and VCCO
  voltage difference between VCCO and VCCAUX must not exceed 2.625V for longer than TVCCO2VCCAUX
  power-on sequence to achieve minimum current draw for the GTP transceivers is VCCINT, VMGTAVCC,
  VMGTAVTT OR VMGTAVCC, VCCINT, VMGTAVTT. There is no recommended sequencing for VMGTVCCAUX. Both VMGTAVCC and
  VCCINT can be ramped simultaneously. The recommended power-off sequence is the reverse of the power-on sequence to
  achieve minimum current draw.
  When VMGTAVTT is powered before VMGTAVCC and VMGTAVTT – VMGTAVCC > 150 mV and VMGTAVCC < 0.7V, the
  VMGTAVTT current draw can increase by 460 mA per transceiver during VMGTAVCC ramp up. The duration of the current
  draw can be up to 0.3 x TMGTAVCC (ramp time from GND to 90% of VMGTAVCC). The reverse is true for power-down.
  • When VMGTAVTT is powered before VCCINT and VMGTAVTT – VCCINT > 150 mV and VCCINT < 0.7V, the VMGTAVTT current
  draw can increase by 50 mA per transceiver during VCCINT ramp up. The duration of the current draw can be up to
  0.3 x TVCCINT (ramp time from GND to 90% of VCCINT). The reverse is true for power-down.
- (near IC2#2) 1.8 +/- 0.09V
- 1.3A
- (near IC2#2) 1.2V+/- 03
- 14A
- 1V+/- 03
- (near IC2#2) 1V+/- 50mV
- 1.2V+/- 03
- (near IC2#2) 1V +/- 50mV
- 1...1.89V
- 1.25V +/- 0.50
- 1.8 +/- 0.09V
- (near IC2#2) For VCCO_17 and 37 please follow:
  " VCCO pins in unbonded banks must be connected to the VCCO for that bank for package migration. Do NOT connect unbonded VCCO pins to different supplies. Without a package migration requirement, VCCO pins in unbonded banks can be tied to a common supply (VCCO or ground)"
  No migration available (since there is no 350T) - I recommend connecting to comfy power rail and using as power decoupling placeholder for decaps. Remove bulks C222 and C219
- Project/Equipment
- Document
- Designer
- Drawn by
- Check.by
- Last Mod.
- Copyright WUT ISE 2020
  This documentation describes Open Hardware and is licensed under CERN OHL v.1.1. You may redistribute and modify this documentaction under the terms of the CERN OHL v1.1.
  (http://ohwr.org/CERNOHL). This documentation is dristributed WITHOUT ANY EXPRESS OR IMPLIED WARRANTY, INCLUDING OF MERCHANTABLITY, SATISFACTORY QUALITY AND FITNESS FOR A PARTICULAR PURPOSE. Please see the CERN OHL v.1.1 for applicable conditions
- Contact:
- File
- Print Date
- Sheet
- Size
- A2
- of
- Rev
- (in symbol BATH_KEYSTONE_2998) +
- (in symbol CAEM7343-20_150UF_2V_20%_LESR0009) +

### Library data of the parts
BAT1 = BATTERY_SR60: SR60 6.8x2.15mm Battery 1.5V, 15mAh
BH1 = BATH_KEYSTONE_2998: Battery Holder whit 2 Pin; Part Description: SMD Battery Holder for MC621, V364, SC621, DR13H, DR77, V13AT, 377 Button Cells; Manufacturer Part Number: 2998; PressFit: No; Part Number: BATH_KEYSTONE_2998; Component Kind: Standard; Component Type: Standard; Pin Count: 3; PackageDescription: SMD Battery Holder for MC621, V364, SC621, DR13H, DR77, V13AT, 377 Button Cells; Family: Battery; Mounted: Yes; Socket: No; SMD: Yes; Sense: No; Manufacturer: KEYSTONE; ComponentHeight: 3.048mm; HelpURL: \\cern.ch\dfs\Applications\Altium\Datasheets\BATH_KEYSTONE_2998.pdf; Author: CERN DEM JLC; CreateDate: 03.07.2014; LatestRevisionDate: 07.06.2017
C106 C107 C237 C238 C267 C268 C272 C446 C478 C576-C583 C585 C586 C588 C589 C591 C594 C596-C598 C605-C611 C636 C637 C644-C646 C652-C654 C660-C662 C668-C670 C680-C682 C688-C690 C696-C698 C704-C706 = CC0603_4.7UF_6.3V_10%_X5R: Non-polarised capacitor; Part Description: SMD Multilayer Chip Ceramic Capacitor; Manufacturer: GENERIC; Manufacturer1 Part Number: 225520613672; Voltage: 6.3V; TC: X5R; Tolerance: ±10%; Table: Capacitors SMD; Part Number: CC0603_4.7UF_6.3V_10%_X5R; Component Kind: Standard; Component Type: Standard; Pin Count: 2; Value: 4.7uF; Status: Preferred; Manufacturer Part Number: CC0603_4.7uF_6.3V_10%_X5R; Case: 0603; Mounted: Yes; Socket: No; SMD: Yes; Manufacturer1 Example: PHYCOMP; Manufacturer1 ComponentHeight: 0.87mm; HelpURL: \\cern.ch\dfs\Applications\Altium\Datasheets\CC0805_X5R_PHYCOMP_HC.pdf; Author: CERN DEM JLC; CreateDate: 2007-12-03; LatestRevisionDate: 2007-12-03
C226 C447 C587 C592 C593 C602 C612 C638 C676-C679 C712-C715 = CC1210_100UF_6.3V_20%_X5R: Non-polarised capacitor; Part Description: SMD Multilayer Chip Ceramic Capacitor; Manufacturer: GENERIC; Manufacturer1 Part Number: GRM32ER60J107ME20L; Voltage: 6.3V; TC: X5R; Tolerance: ±20%; Table: Capacitors SMD; Part Number: CC1210_100UF_6.3V_20%_X5R; Component Kind: Standard; Component Type: Standard; Pin Count: 2; Value: 100uF; Status: Preferred; Manufacturer Part Number: CC1210_100UF_6.3V_20%_X5R; Case: 1210; Mounted: Yes; Socket: No; SMD: Yes; Manufacturer1 Example: MURATA; Manufacturer1 ComponentHeight: 2.70mm; HelpURL: \\cern.ch\dfs\Applications\Altium\Datasheets\CC1210_X5R_MURATA.pdf; Author: CERN DEM JLC; CreateDate: 2010-04-19; LatestRevisionDate: 2010-04-19
C229 C232-C236 C239-C250 C264-C266 C269-C271 C275-C280 C283-C288 C291-C296 C549-C566 C738-C748 = CC0201_220NF_6.3V_20%_X5R: Non-polarised capacitor; Part Description: SMD Multilayer Chip Ceramic Capacitor; Manufacturer: GENERIC; Manufacturer1 Part Number: JMK063BJ224MP-F; Voltage: 6.3V; TC: X5R; Tolerance: ±20%; Table: Capacitors SMD; Part Number: CC0201_220NF_6.3V_20%_X5R; Component Kind: Standard; Component Type: Standard; Pin Count: 2; Value: 220nF; Status: Not Recommended; Manufacturer Part Number: CC0201_220NF_6.3V_20%_X5R; Case: 0201; Mounted: Yes; Socket: No; SMD: Yes; Manufacturer1 Example: TAIYO YUDEN; Manufacturer1 ComponentHeight: 0.33mm; HelpURL: \\cern.ch\dfs\Applications\Altium\Datasheets\CC0201_X5R_TAIYO-YUDEN_STANDARD-CLASS2.pdf; Author: CERN DEM JLC; CreateDate: 2010-05-27; LatestRevisionDate: 2010-05-27
C230 C231 = CAEM7343-20_150UF_2V_20%_LESR0009: Polarised capacitor; Part Description: ESR 0R009 Polymer Aluminum Electrolytic Capacitor; Manufacturer: MURATA; Manufacturer Part Number: ECASD40D157M009K00; Voltage: 2V; Tolerance: ±20%; Part Number: CAEM7343-20_150UF_2V_20%_LESR0009; Component Kind: Standard; Component Type: Standard; Pin Count: 2; Value: 150uF; Status: None; Mounted: Yes; Socket: No; SMD: Yes; Sense: No; ComponentHeight: 2mm; HelpURL: \\cern.ch\dfs\Applications\Altium\Datasheets\CAEM_MURATA_ECAS.pdf; Author: CERN DEM JLC; CreateDate: 11.01.2012; LatestRevisionDate: 11.01.2012
C251-C254 C259 C599-C601 C722-C725 C730-C733 = CC0201_22NF_6.3V_10%_X5R: Non-polarised capacitor; Part Description: SMD Multilayer Chip Ceramic Capacitor; Manufacturer: GENERIC; Manufacturer1 Part Number: 02016D223KAT2A; Voltage: 6.3V; TC: X5R; Tolerance: ±10%; Table: Capacitors SMD; Part Number: CC0201_22NF_6.3V_10%_X5R; Component Kind: Standard; Component Type: Standard; Pin Count: 2; Value: 22nF; Status: Not Recommended; Manufacturer Part Number: CC0201_22NF_6.3V_10%_X5R; Case: 0201; Mounted: Yes; Socket: No; SMD: Yes; Manufacturer1 Example: AVX; Manufacturer1 ComponentHeight: 0.33mm; HelpURL: \\cern.ch\dfs\Applications\Altium\Datasheets\CC0201_X5R_AVX.pdf; Author: CERN DEM JLC; CreateDate: 2007-12-03; LatestRevisionDate: 2007-12-03
C255-C258 C262 C263 C604 C726-C729 C734-C737 = CC0201_100NF_6.3V_10%_X5R: Non-polarised capacitor; Part Description: SMD Multilayer Chip Ceramic Capacitor; Manufacturer: GENERIC; Manufacturer1 Part Number: 02016D104KAT2A; Voltage: 6.3V; TC: X5R; Tolerance: ±10%; Table: Capacitors SMD; Part Number: CC0201_100NF_6.3V_10%_X5R; Component Kind: Standard; Component Type: Standard; Pin Count: 2; Value: 100nF; Status: Not Recommended; Manufacturer Part Number: CC0201_100NF_6.3V_10%_X5R; Case: 0201; Mounted: Yes; Socket: No; SMD: Yes; Manufacturer1 Example: AVX; Manufacturer1 ComponentHeight: 0.33mm; HelpURL: \\cern.ch\dfs\Applications\Altium\Datasheets\CC0201_X5R_AVX.pdf; Author: CERN DEM JLC; CreateDate: 2007-12-03; LatestRevisionDate: 2007-12-03
C260 C261 C448-C451 C465 C603 C614 C615 C639-C643 C647-C651 C655-C659 C663-C667 C671-C675 C683-C687 C691-C695 C699-C703 C707-C711 C716-C721 = CC0201_470NF_4V_20%_X5R: Non-polarised capacitor; Part Description: SMD Multilayer Chip Ceramic Capacitor; Manufacturer: GENERIC; Manufacturer1 Part Number: AMK063BJ474MP-F; Voltage: 4V; TC: X5R; Tolerance: ±20%; Table: Capacitors SMD; Part Number: CC0201_470NF_4V_20%_X5R; Component Kind: Standard; Component Type: Standard; Pin Count: 2; Value: 470nF; Status: Not Recommended; Manufacturer Part Number: CC0201_470NF_4V_20%_X5R; Case: 0201; Mounted: Yes; Socket: No; SMD: Yes; Manufacturer1 Example: TAIYO YUDEN; Manufacturer1 ComponentHeight: 0.33mm; HelpURL: \\cern.ch\dfs\Applications\Altium\Datasheets\CC0201_X5R_TAIYO-YUDEN_STANDARD-CLASS2.pdf; Author: CERN DEM JLC; CreateDate: 2010-05-27; LatestRevisionDate: 2010-05-27
FB5-FB8 = IND1806_MURATA_BLM41PG600SN1L: Part Description: SMD EMI Suppression Chip Ferrite Bead (BLM41P Series); Manufacturer: MURATA; Power: 6A; Resistance: 0.01R; Part Number: IND1806_MURATA_BLM41PG600SN1L; Component Kind: Standard; Component Type: Standard; Pin Count: 2; Value: 60R@100MHz; Status: None; Manufacturer Part Number: BLM41PG600SN1L; Case: 1806; Mounted: Yes; Socket: No; SMD: Yes; Sense: No; ComponentHeight: 1.8mm; HelpURL: \\cern.ch\dfs\Applications\Altium\Datasheets\IND1806_MURATA_BLM41P.pdf; Author: CERN DEM JLC; CreateDate: 02.12.2009; LatestRevisionDate: 02.12.2009
IC2#2 = XC7A200T-3FFG1156C: Artix-6 FPGA, 16 GTPs, 600 User I/Os, 1156-Pin BGA, Speed Grade 2, Commercial Grade, Pb-Free; Part Description: Artix-7 FPGA, 16 GTPs, 600 User I/Os, 1156-Pin BGA, Speed Grade 2, Commercial Grade, Pb-Free; Manufacturer: XILINX; Table: Logic; Part Number: XC7A200T-3FFG1156C; Component Kind: Standard; Component Type: Standard; Device: XC7A200T-3FFG1156C; PackageDescription: BGA, 1.00mm Pitch, Square; 1156 Pin, 34 Columns X 34 Rows, 35.00mm X 35.00mm X 3.350mm H; Manufacturer Part Number: XC7A200T-3FFG1156C; Pin Count: 1156; Case: BGA1156; Mounted: Yes; Socket: No; SMD: Yes; ComponentHeight: 3.35mm; HelpURL: \\cern.ch\dfs\Applications\Altium\Datasheets\XC7A350T-2FFG1156C.pdf; ComponentLink1URL: \\cern.ch\dfs\Applications\Altium\Datasheets\XC7A350T-2FFG1156C.pdf; ComponentLink1Description: Package/Pinout; Author: CERN DEM JLC; CreateDate: 2012-09-19; LatestRevisionDate: 2012-09-19
L10 L12 = IND_1UH_30%_PANASONIC_ELLVGG1R0N: Inductor With Core; Part Description: Wire Wound SMD Power Inductor, G Series, Type ELLVGG; Power: 1.8A; Resistance: 0.052R; Tolerance: ±30%; Part Number: IND_1UH_30%_PANASONIC_ELLVGG1R0N; Component Kind: Standard; Component Type: Standard; Pin Count: 2; Value: 1uH; Status: None; Manufacturer: PANASONIC; Manufacturer Part Number: ELLVGG1R0N; Mounted: Yes; Socket: No; SMD: Yes; Sense: No; ComponentHeight: 1.5mm; HelpURL: \\cern.ch\dfs\Applications\Altium\Datasheets\IND_PANASONIC_ELLVGG.pdf; Author: CERN DEM JLC; CreateDate: 09.11.2016; LatestRevisionDate: 09.11.2016